# Altium schematic sheet cpu.SchDoc
size A2
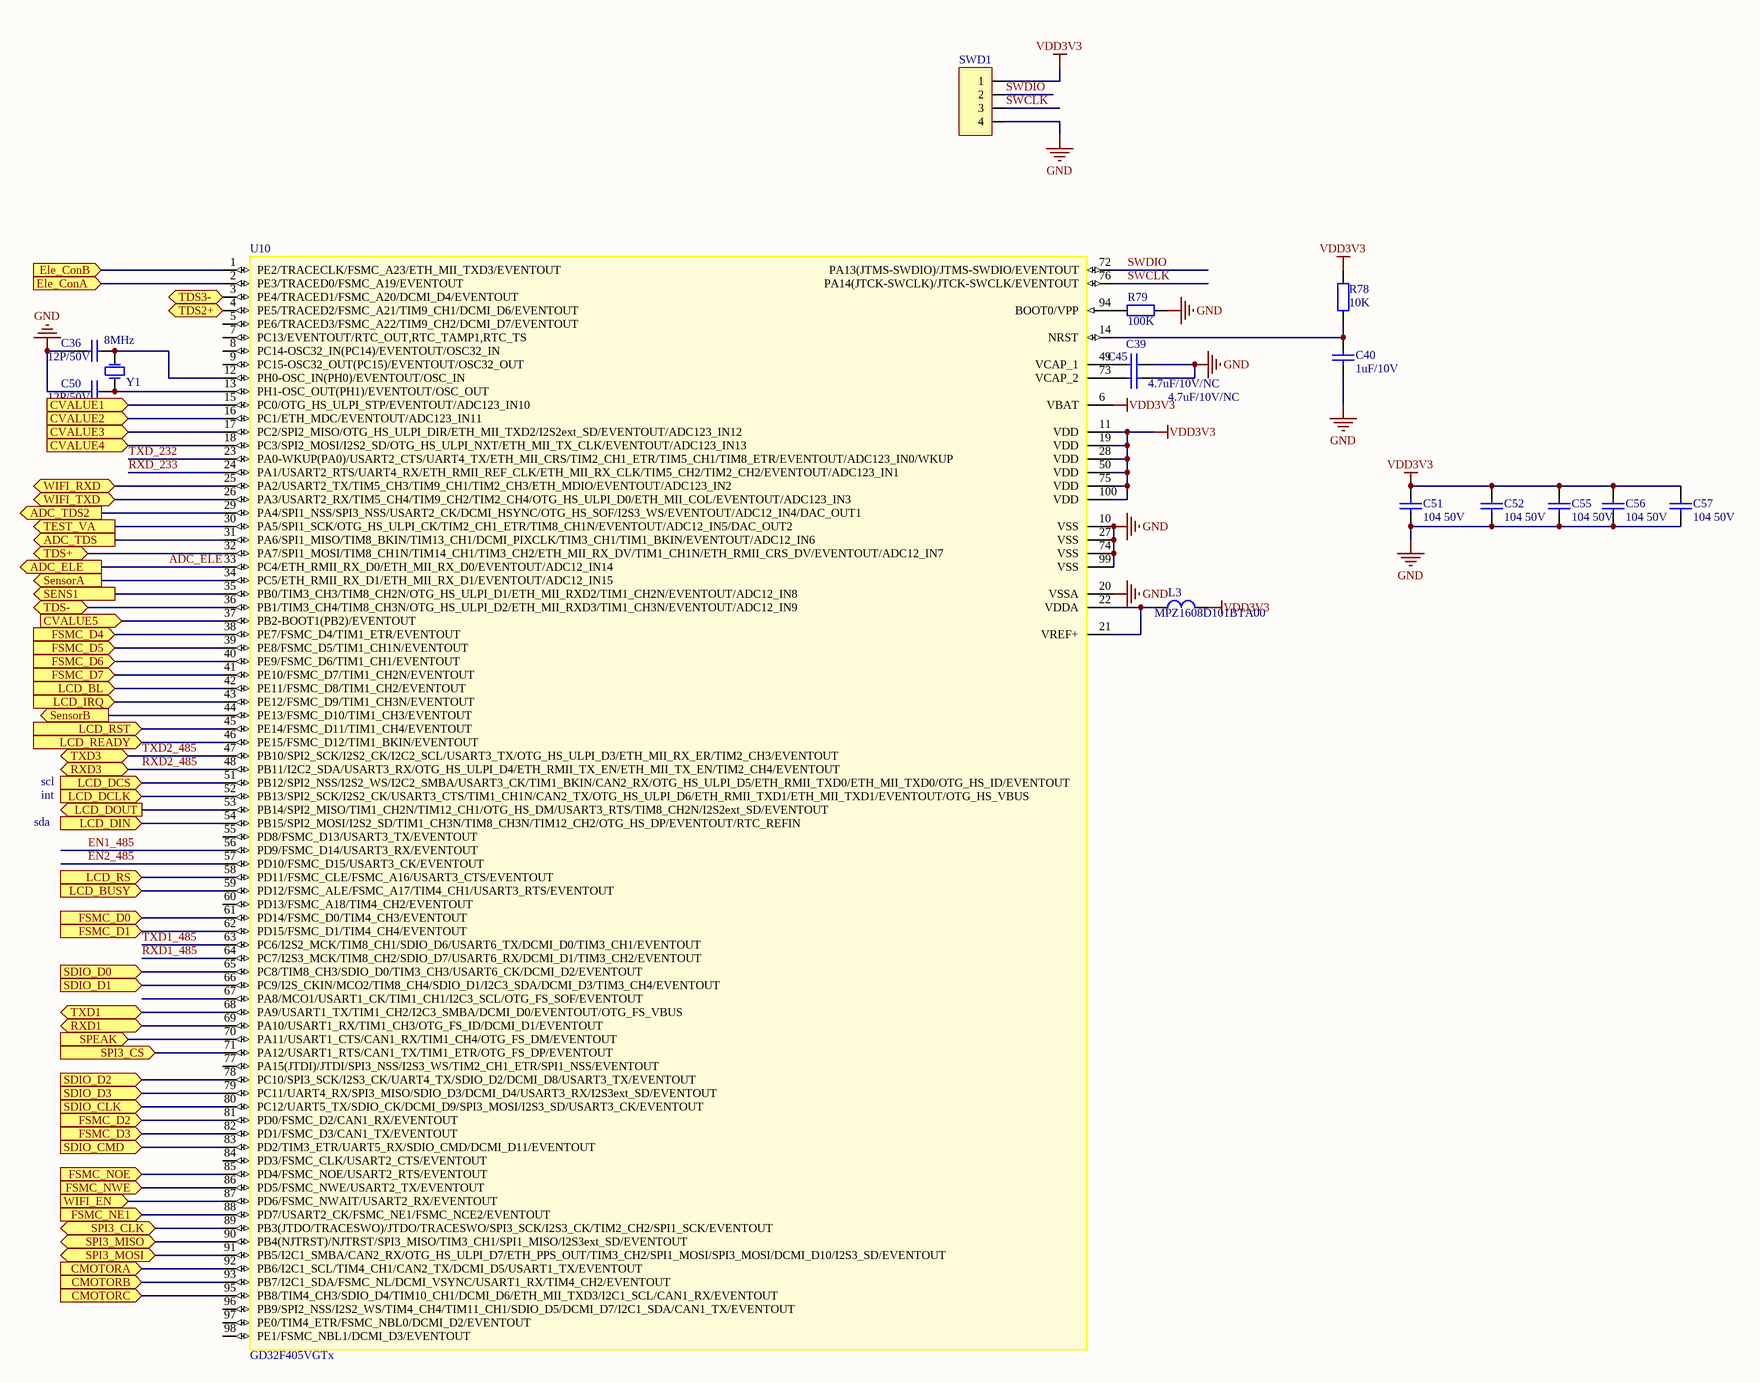
[diagram p0: cpu.SchDoc]

## Parts
C36  12P/50V  [SMD-0603C]
C39  4.7uF/10V/NC  [SMD-0603C]
C40  1uF/10V  [SMD-0603C]
C45  4.7uF/10V/NC  [SMD-0603C]
C50  12P/50V  [SMD-0603C]
C51  104 50V  [SMD-0603C]
C52  104 50V  [SMD-0603C]
C55  104 50V  [SMD-0603C]
C56  104 50V  [SMD-0603C]
C57  104 50V  [SMD-0603C]
L3  MPZ1608D101BTA00  [SMD-0603]
R78  10K  [SMD-0603]
R79  100K  [SMD-0603]
SWD1  SIP-4 (NC)  [SIP-4]  (value not drawn)
U10  GD32F405VGTx  [STM-LQFP100_N]
Y1  8MHz  [XTAL-3225-2]

## Ports
ADC_ELE (out), ADC_TDS2 (out), ADC_TDS (out), CMOTORA (in), CMOTORB (in), CMOTORC (in), CVALUE1 (in), CVALUE2 (in), CVALUE3 (in), CVALUE4 (in), CVALUE5 (in), Ele_ConA (in), Ele_ConB (in), FSMC_D0 (in), FSMC_D1 (in), FSMC_D2 (in), FSMC_D3 (in), FSMC_D4 (in), FSMC_D5 (in), FSMC_D6 (in), FSMC_D7 (in), FSMC_NE1 (in), FSMC_NOE (in), FSMC_NWE (in), LCD_BL (in), LCD_BUSY (in), LCD_DCLK (in), LCD_DCS (in), LCD_DIN (in), LCD_DOUT (out), LCD_IRQ (in), LCD_READY (in), LCD_RS (in), LCD_RST (in), RXD1 (bidir), RXD3 (bidir), SDIO_CLK (in), SDIO_CMD (in), SDIO_D0 (in), SDIO_D1 (in), SDIO_D2 (in), SDIO_D3 (in), SENS1 (out), SensorA (out), SensorB (out), SPEAK (in), SPI3_CLK (bidir), SPI3_CS (in), SPI3_MISO (bidir), SPI3_MOSI (bidir), TDS2+ (bidir), TDS3- (bidir), TDS+ (bidir), TDS- (bidir), TEST_VA (out), TXD1 (bidir), TXD3 (bidir), WIFI_EN (in), WIFI_RXD (bidir), WIFI_TXD (bidir)

## Nets
GND: C36.2 C39.1 C40.1 C45.1 C50.2 C51.1 C52.1 C55.1 C56.1 C57.1 R79.1 SWD1.4 U10.10(VSS) U10.20(VSSA) U10.27(VSS) U10.74(VSS) U10.99(VSS)
VDD3V3: C51.2 C52.2 C55.2 C56.2 C57.2 L3.1 R78.2 SWD1.1 U10.6(VBAT) U10.11(VDD) U10.19(VDD) U10.28(VDD) U10.50(VDD) U10.75(VDD) U10.100(VDD)
ADC_ELE: U10.33(PC4/ETH_RMII_RX_D0/ETH_MII_RX_D0/EVENTOUT/ADC12_IN14) ; port ADC_ELE
ADC_TDS: U10.31(PA6/SPI1_MISO/TIM8_BKIN/TIM13_CH1/DCMI_PIXCLK/TIM3_CH1/TIM1_BKIN/EVENTOUT/ADC12_IN6) ; port ADC_TDS
ADC_TDS2: U10.29(PA4/SPI1_NSS/SPI3_NSS/USART2_CK/DCMI_HSYNC/OTG_HS_SOF/I2S3_WS/EVENTOUT/ADC12_IN4/DAC_OUT1) ; port ADC_TDS2
CMOTORA: U10.92(PB6/I2C1_SCL/TIM4_CH1/CAN2_TX/DCMI_D5/USART1_TX/EVENTOUT) ; port CMOTORA
CMOTORB: U10.93(PB7/I2C1_SDA/FSMC_NL/DCMI_VSYNC/USART1_RX/TIM4_CH2/EVENTOUT) ; port CMOTORB
CMOTORC: U10.95(PB8/TIM4_CH3/SDIO_D4/TIM10_CH1/DCMI_D6/ETH_MII_TXD3/I2C1_SCL/CAN1_RX/EVENTOUT) ; port CMOTORC
CVALUE1: U10.15(PC0/OTG_HS_ULPI_STP/EVENTOUT/ADC123_IN10) ; port CVALUE1
CVALUE2: U10.16(PC1/ETH_MDC/EVENTOUT/ADC123_IN11) ; port CVALUE2
CVALUE3: U10.17(PC2/SPI2_MISO/OTG_HS_ULPI_DIR/ETH_MII_TXD2/I2S2ext_SD/EVENTOUT/ADC123_IN12) ; port CVALUE3
CVALUE4: U10.18(PC3/SPI2_MOSI/I2S2_SD/OTG_HS_ULPI_NXT/ETH_MII_TX_CLK/EVENTOUT/ADC123_IN13) ; port CVALUE4
CVALUE5: U10.37(PB2-BOOT1(PB2)/EVENTOUT) ; port CVALUE5
Ele_ConA: U10.2(PE3/TRACED0/FSMC_A19/EVENTOUT) ; port Ele_ConA
Ele_ConB: U10.1(PE2/TRACECLK/FSMC_A23/ETH_MII_TXD3/EVENTOUT) ; port Ele_ConB
EN1_485: U10.56(PD9/FSMC_D14/USART3_RX/EVENTOUT)
EN2_485: U10.57(PD10/FSMC_D15/USART3_CK/EVENTOUT)
FSMC_D0: U10.61(PD14/FSMC_D0/TIM4_CH3/EVENTOUT) ; port FSMC_D0
FSMC_D1: U10.62(PD15/FSMC_D1/TIM4_CH4/EVENTOUT) ; port FSMC_D1
FSMC_D2: U10.81(PD0/FSMC_D2/CAN1_RX/EVENTOUT) ; port FSMC_D2
FSMC_D3: U10.82(PD1/FSMC_D3/CAN1_TX/EVENTOUT) ; port FSMC_D3
FSMC_D4: U10.38(PE7/FSMC_D4/TIM1_ETR/EVENTOUT) ; port FSMC_D4
FSMC_D5: U10.39(PE8/FSMC_D5/TIM1_CH1N/EVENTOUT) ; port FSMC_D5
FSMC_D6: U10.40(PE9/FSMC_D6/TIM1_CH1/EVENTOUT) ; port FSMC_D6
FSMC_D7: U10.41(PE10/FSMC_D7/TIM1_CH2N/EVENTOUT) ; port FSMC_D7
FSMC_NE1: U10.88(PD7/USART2_CK/FSMC_NE1/FSMC_NCE2/EVENTOUT) ; port FSMC_NE1
FSMC_NOE: U10.85(PD4/FSMC_NOE/USART2_RTS/EVENTOUT) ; port FSMC_NOE
FSMC_NWE: U10.86(PD5/FSMC_NWE/USART2_TX/EVENTOUT) ; port FSMC_NWE
LCD_BL: U10.42(PE11/FSMC_D8/TIM1_CH2/EVENTOUT) ; port LCD_BL
LCD_BUSY: U10.59(PD12/FSMC_ALE/FSMC_A17/TIM4_CH1/USART3_RTS/EVENTOUT) ; port LCD_BUSY
LCD_DCLK: U10.52(PB13/SPI2_SCK/I2S2_CK/USART3_CTS/TIM1_CH1N/CAN2_TX/OTG_HS_ULPI_D6/ETH_RMII_TXD1/ETH_MII_TXD1/EVENTOUT/OTG_HS_VBUS) ; port LCD_DCLK
LCD_DCS: U10.51(PB12/SPI2_NSS/I2S2_WS/I2C2_SMBA/USART3_CK/TIM1_BKIN/CAN2_RX/OTG_HS_ULPI_D5/ETH_RMII_TXD0/ETH_MII_TXD0/OTG_HS_ID/EVENTOUT) ; port LCD_DCS
LCD_DIN: U10.54(PB15/SPI2_MOSI/I2S2_SD/TIM1_CH3N/TIM8_CH3N/TIM12_CH2/OTG_HS_DP/EVENTOUT/RTC_REFIN) ; port LCD_DIN
LCD_DOUT: U10.53(PB14/SPI2_MISO/TIM1_CH2N/TIM12_CH1/OTG_HS_DM/USART3_RTS/TIM8_CH2N/I2S2ext_SD/EVENTOUT) ; port LCD_DOUT
LCD_IRQ: U10.43(PE12/FSMC_D9/TIM1_CH3N/EVENTOUT) ; port LCD_IRQ
LCD_READY: U10.46(PE15/FSMC_D12/TIM1_BKIN/EVENTOUT) ; port LCD_READY
LCD_RS: U10.58(PD11/FSMC_CLE/FSMC_A16/USART3_CTS/EVENTOUT) ; port LCD_RS
LCD_RST: U10.45(PE14/FSMC_D11/TIM1_CH4/EVENTOUT) ; port LCD_RST
RXD1: U10.69(PA10/USART1_RX/TIM1_CH3/OTG_FS_ID/DCMI_D1/EVENTOUT) ; port RXD1
RXD1_485: U10.64(PC7/I2S3_MCK/TIM8_CH2/SDIO_D7/USART6_RX/DCMI_D1/TIM3_CH2/EVENTOUT)
RXD2_485: U10.48(PB11/I2C2_SDA/USART3_RX/OTG_HS_ULPI_D4/ETH_RMII_TX_EN/ETH_MII_TX_EN/TIM2_CH4/EVENTOUT) ; port RXD3
RXD_233: U10.24(PA1/USART2_RTS/UART4_RX/ETH_RMII_REF_CLK/ETH_MII_RX_CLK/TIM5_CH2/TIM2_CH2/EVENTOUT/ADC123_IN1)
SDIO_CLK: U10.80(PC12/UART5_TX/SDIO_CK/DCMI_D9/SPI3_MOSI/I2S3_SD/USART3_CK/EVENTOUT) ; port SDIO_CLK
SDIO_CMD: U10.83(PD2/TIM3_ETR/UART5_RX/SDIO_CMD/DCMI_D11/EVENTOUT) ; port SDIO_CMD
SDIO_D0: U10.65(PC8/TIM8_CH3/SDIO_D0/TIM3_CH3/USART6_CK/DCMI_D2/EVENTOUT) ; port SDIO_D0
SDIO_D1: U10.66(PC9/I2S_CKIN/MCO2/TIM8_CH4/SDIO_D1/I2C3_SDA/DCMI_D3/TIM3_CH4/EVENTOUT) ; port SDIO_D1
SDIO_D2: U10.78(PC10/SPI3_SCK/I2S3_CK/UART4_TX/SDIO_D2/DCMI_D8/USART3_TX/EVENTOUT) ; port SDIO_D2
SDIO_D3: U10.79(PC11/UART4_RX/SPI3_MISO/SDIO_D3/DCMI_D4/USART3_RX/I2S3ext_SD/EVENTOUT) ; port SDIO_D3
SENS1: U10.35(PB0/TIM3_CH3/TIM8_CH2N/OTG_HS_ULPI_D1/ETH_MII_RXD2/TIM1_CH2N/EVENTOUT/ADC12_IN8) ; port SENS1
SensorA: U10.34(PC5/ETH_RMII_RX_D1/ETH_MII_RX_D1/EVENTOUT/ADC12_IN15) ; port SensorA
SensorB: U10.44(PE13/FSMC_D10/TIM1_CH3/EVENTOUT) ; port SensorB
SPEAK: U10.70(PA11/USART1_CTS/CAN1_RX/TIM1_CH4/OTG_FS_DM/EVENTOUT) ; port SPEAK
SPI3_CLK: U10.89(PB3(JTDO/TRACESWO)/JTDO/TRACESWO/SPI3_SCK/I2S3_CK/TIM2_CH2/SPI1_SCK/EVENTOUT) ; port SPI3_CLK
SPI3_CS: U10.71(PA12/USART1_RTS/CAN1_TX/TIM1_ETR/OTG_FS_DP/EVENTOUT) ; port SPI3_CS
SPI3_MISO: U10.90(PB4(NJTRST)/NJTRST/SPI3_MISO/TIM3_CH1/SPI1_MISO/I2S3ext_SD/EVENTOUT) ; port SPI3_MISO
SPI3_MOSI: U10.91(PB5/I2C1_SMBA/CAN2_RX/OTG_HS_ULPI_D7/ETH_PPS_OUT/TIM3_CH2/SPI1_MOSI/SPI3_MOSI/DCMI_D10/I2S3_SD/EVENTOUT) ; port SPI3_MOSI
SWCLK: SWD1.3 U10.76(PA14(JTCK-SWCLK)/JTCK-SWCLK/EVENTOUT)
SWDIO: SWD1.2 U10.72(PA13(JTMS-SWDIO)/JTMS-SWDIO/EVENTOUT)
TDS2+: U10.4(PE5/TRACED2/FSMC_A21/TIM9_CH1/DCMI_D6/EVENTOUT) ; port TDS2+
TDS3-: U10.3(PE4/TRACED1/FSMC_A20/DCMI_D4/EVENTOUT) ; port TDS3-
TDS+: U10.32(PA7/SPI1_MOSI/TIM8_CH1N/TIM14_CH1/TIM3_CH2/ETH_MII_RX_DV/TIM1_CH1N/ETH_RMII_CRS_DV/EVENTOUT/ADC12_IN7) ; port TDS+
TDS-: U10.36(PB1/TIM3_CH4/TIM8_CH3N/OTG_HS_ULPI_D2/ETH_MII_RXD3/TIM1_CH3N/EVENTOUT/ADC12_IN9) ; port TDS-
TEST_VA: U10.30(PA5/SPI1_SCK/OTG_HS_ULPI_CK/TIM2_CH1_ETR/TIM8_CH1N/EVENTOUT/ADC12_IN5/DAC_OUT2) ; port TEST_VA
TXD1: U10.68(PA9/USART1_TX/TIM1_CH2/I2C3_SMBA/DCMI_D0/EVENTOUT/OTG_FS_VBUS) ; port TXD1
TXD1_485: U10.63(PC6/I2S2_MCK/TIM8_CH1/SDIO_D6/USART6_TX/DCMI_D0/TIM3_CH1/EVENTOUT)
TXD2_485: U10.47(PB10/SPI2_SCK/I2S2_CK/I2C2_SCL/USART3_TX/OTG_HS_ULPI_D3/ETH_MII_RX_ER/TIM2_CH3/EVENTOUT) ; port TXD3
TXD_232: U10.23(PA0-WKUP(PA0)/USART2_CTS/UART4_TX/ETH_MII_CRS/TIM2_CH1_ETR/TIM5_CH1/TIM8_ETR/EVENTOUT/ADC123_IN0/WKUP)
WIFI_EN: U10.87(PD6/FSMC_NWAIT/USART2_RX/EVENTOUT) ; port WIFI_EN
WIFI_RXD: U10.25(PA2/USART2_TX/TIM5_CH3/TIM9_CH1/TIM2_CH3/ETH_MDIO/EVENTOUT/ADC123_IN2) ; port WIFI_RXD
WIFI_TXD: U10.26(PA3/USART2_RX/TIM5_CH4/TIM9_CH2/TIM2_CH4/OTG_HS_ULPI_D0/ETH_MII_COL/EVENTOUT/ADC123_IN3) ; port WIFI_TXD
NetC36_1: C36.1 U10.12(PH0-OSC_IN(PH0)/EVENTOUT/OSC_IN) Y1.2(OSC2)
NetC39_2: C39.2 U10.49(VCAP_1)
NetC40_2: C40.2 R78.1 U10.14(NRST)
NetC45_2: C45.2 U10.73(VCAP_2)
NetC50_1: C50.1 U10.13(PH1-OSC_OUT(PH1)/EVENTOUT/OSC_OUT) Y1.1(OSC1)
NetL3_2: L3.2 U10.21(VREF+) U10.22(VDDA)
NetR79_2: R79.2 U10.94(BOOT0/VPP)

Not connected (* = marked no-connect by the designer): U10 5(PE6/TRACED3/FSMC_A22/TIM9_CH2/DCMI_D7/EVENTOUT) 7(PC13/EVENTOUT/RTC_OUT,RTC_TAMP1,RTC_TS) 8(PC14-OSC32_IN(PC14)/EVENTOUT/OSC32_IN) 9(PC15-OSC32_OUT(PC15)/EVENTOUT/OSC32_OUT) 55(PD8/FSMC_D13/USART3_TX/EVENTOUT) 60(PD13/FSMC_A18/TIM4_CH2/EVENTOUT) 67(PA8/MCO1/USART1_CK/TIM1_CH1/I2C3_SCL/OTG_FS_SOF/EVENTOUT) 77(PA15(JTDI)/JTDI/SPI3_NSS/I2S3_WS/TIM2_CH1_ETR/SPI1_NSS/EVENTOUT) 84(PD3/FSMC_CLK/USART2_CTS/EVENTOUT) 96(PB9/SPI2_NSS/I2S2_WS/TIM4_CH4/TIM11_CH1/SDIO_D5/DCMI_D7/I2C1_SDA/CAN1_TX/EVENTOUT) 97(PE0/TIM4_ETR/FSMC_NBL0/DCMI_D2/EVENTOUT) 98(PE1/FSMC_NBL1/DCMI_D3/EVENTOUT)

## Notes on the sheet
- scl
- int
- sda

## Library data of the parts
C36 C50 = CAP4: 贴片电容 5%
C39 C40 C45 C51 C52 C55-C57 = CAP4: 贴片电容 20%
L3 = CIZHU1: 磁珠电感 100R 100MHz
R78 R79 = RES2: 贴片电阻 5%
SWD1 = SIP-4: ISP 下载
U10 = STM32F405VGTx: Manufacturer: STMicroelectronics; PartNumber: STM32F405VGT6; Core: ARM Cortex-M4; D/A Converter: 2x12-bit; FLASH Size (Prog) (kB): 1024; I/Os (High Current): 82; Internal RAM Size (kB): 192; Operating Frequency(F) (Processor speed) (MHz): 168; Packing: Tray; Supply Voltage(Vcc) max (V): 3.6; Supply Voltage(Vcc) min (V): 1.8; DatasheetVersion: Rev. 4; PackageVersion: Rev. 1, 06/2013; PackageReference: LQFP100; PackageDescription: 100-Pin Low Profile Quad Flat Package, 14 x 14 mm Body, 0.5 mm Pitch; Mounting Technology: Surface Mount; ComponentLink1Description: Manufacturer URL; ComponentLink1URL: http://www.st.com/web/en/home.html; ComponentLink2Description: Datasheet; ComponentLink2URL: http://www.st.com/st-web-ui/static/active/en/resource/technical/document/datasheet/DM00037051.pdf; ComponentLink3Description: Package Specification; ComponentLink3URL: http://www.st.com/st-web-ui/static/active/en/resource/technical/document/data_brief/DM00071938.pdf
Y1 = XTAL: 3225 贴片晶振